# Altium schematic sheet FingerPrint.SchDoc: Access Control
size A; DrawnBy: Q.Thang & T.Khoa; Revision: V1.0.1; SheetNumber: 11; SheetTotal: 16
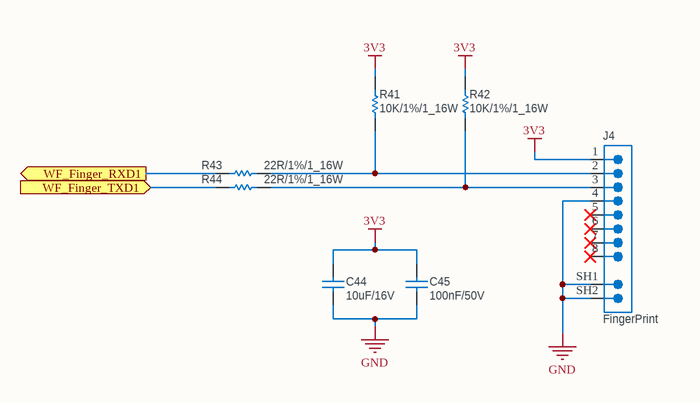
[diagram p0: FingerPrint.SchDoc]

## Parts
C44  10uF/16V  [CAP_0603]
C45  100nF/50V  [CAP_0603]
J4  FingerPrint  [MX_1.25mm_8P]
R41  10K/1%/1_16W  [RESISTOR_0402]
R42  10K/1%/1_16W  [RESISTOR_0402]
R43  22R/1%/1_16W  [RESISTOR_0402]
R44  22R/1%/1_16W  [RESISTOR_0402]

## Ports
WF_Finger_RXD1 (out, see Overview_Schematic[6B], ESP32_WiFi[3A]), WF_Finger_TXD1 (in, see Overview_Schematic[6A], ESP32_WiFi[3A])

## Nets
3V3: C44.2 C45.2 J4.1 R41.2 R42.2
GND: C44.1 C45.1 J4.4 J4.SH1(SHIELD) J4.SH2(SHIELD)
WF_Finger_RXD1: R43.1 ; port WF_Finger_RXD1
WF_Finger_TXD1: R44.1 ; port WF_Finger_TXD1
NetJ4_2: J4.2 R41.1 R43.2
NetJ4_3: J4.3 R42.1 R44.2

Not connected (* = marked no-connect by the designer): J4 5* 6* 7* 8*

## Notes on the sheet
- Project Name
- Size
- A4
- Revision
- Checked By:
- Drawn By:
- Date:
- File:
- Last Modified:
- Sheet
- of

## Library data of the parts
C44 = Ceramic_Cap_10uF_16V_0603: CAP, size 0603, 10uF, 16V; Supply Part Number: Tụ Gốm 0603 10uF 16V; Supply Name: Thegioiic; Datasheet: *; Supply URL: https://www.thegioiic.com/tu-gom-0603-10uf-16v
C45 = Ceramic_Cap_100nF_50V_0603: CAP, size 0603, 100nF, 50V; Supply Part Number: Tụ Gốm 0603 100nF (0.1uF) 50V; Supply Name: Thegioiic; Datasheet: *; Supply URL: https://www.thegioiic.com/tu-gom-0603-100nf-0-1uf-50v
J4 = MX_1.25mm_8P: Đầu MX1.25mm 8 Chân Dán SMD Thẳng Đứng; Supply Name: Thegioiic; Supply Part Number: Đầu MX1.25mm 8 Chân Dán SMD Thẳng Đứng; Supply URL: https://www.thegioiic.com/dau-mx1-25mm-8-chan-dan-smd-thang-dung
R41 R42 = Res_10K_0402_1%: Resistor 0402 10KOhm 1% 1_16W; Supply Part Number: Điện Trở 10 KOhm 0402 1%; Supply Name: Thegioiic; Supply URL: https://www.thegioiic.com/dien-tro-10-kohm-0402-1-
R43 R44 = Res_22R_0402_1%: Resistor 0402 22 Ohm 1% 1_16W; Supply Name: *; Supply Part Number: *; Supply URL: *